# EasyEDA Pro project ax08_duplicate.eprj, schematic register
Board Name: register; Create Date: 2025-05-11; Page Name: P1; Project Name: rlpc; Schematic Name: register; Update Date: 2025-06-16; Company: EasyEDA.com; Page Size: A4; Version: V1.0
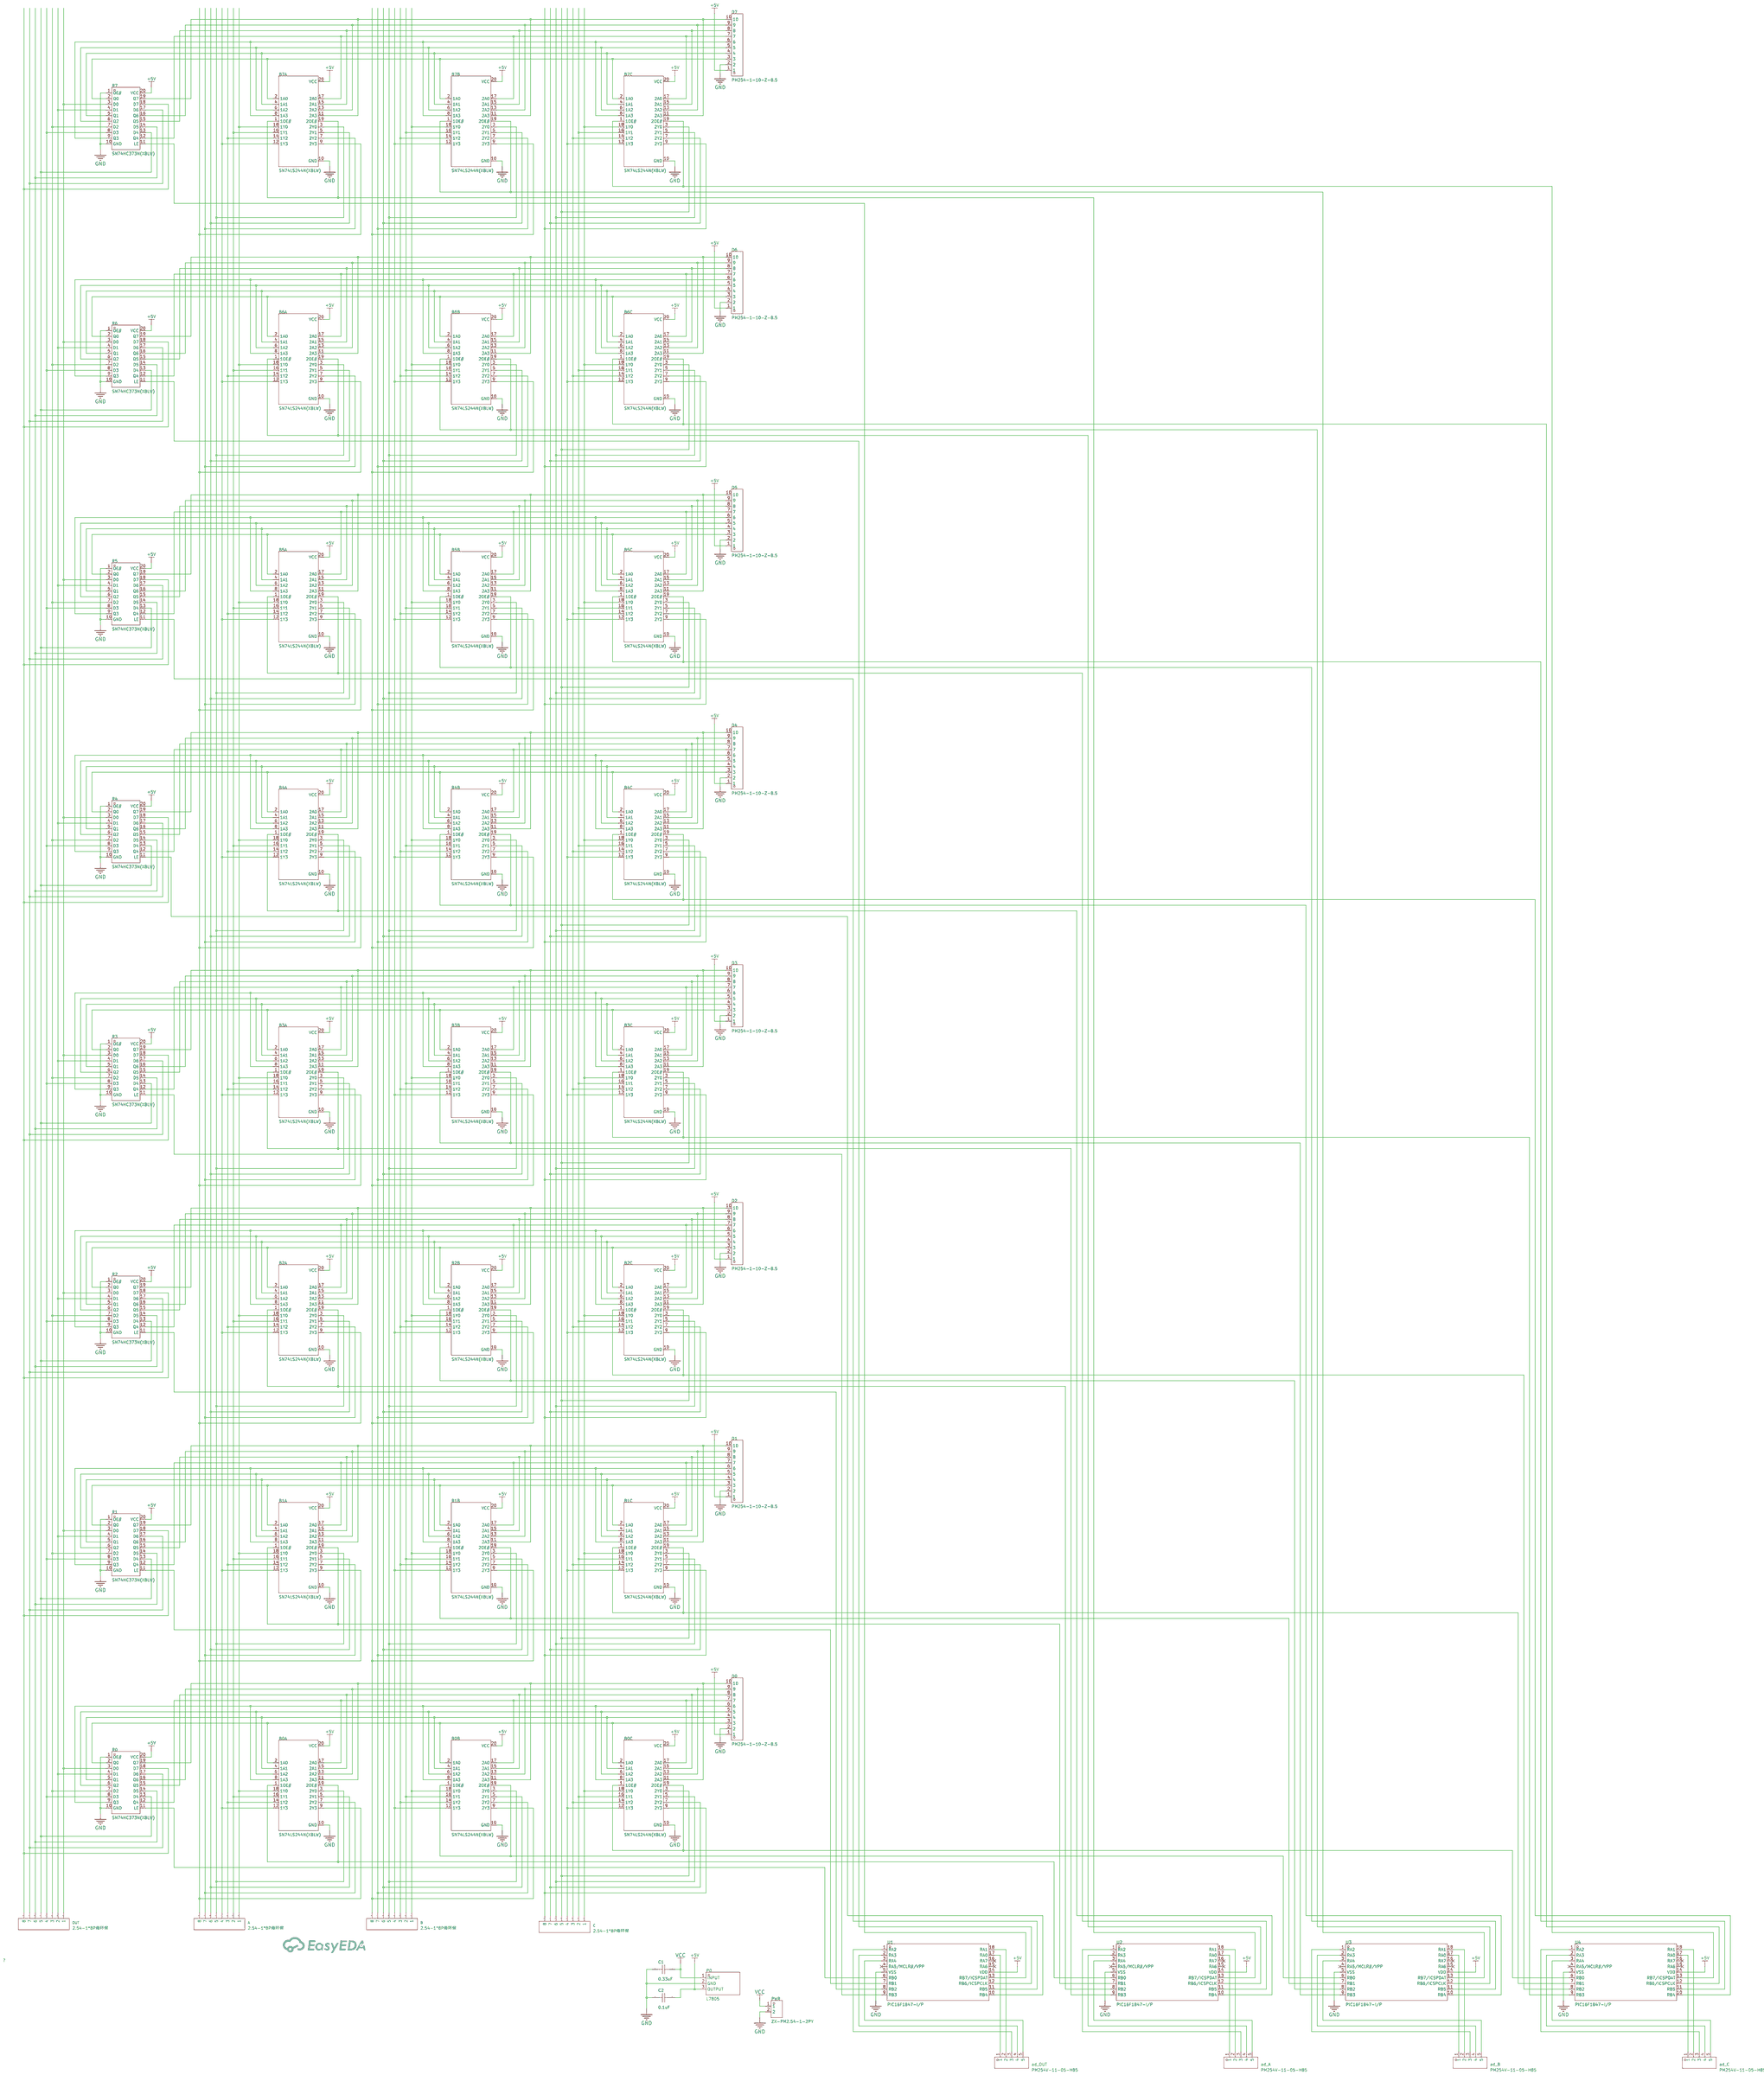
[diagram p3: schematic sheet]

## Parts
A  2.54-1*8P母环保  [HDR-TH_8P-P2.54-V-F-1]
ad_A  PM254V-11-05-H85  [HDR-TH_5P-P2.54-V-F]
ad_B  PM254V-11-05-H85  [HDR-TH_5P-P2.54-V-F]
ad_C  PM254V-11-05-H85  [HDR-TH_5P-P2.54-V-F]
ad_OUT  PM254V-11-05-H85  [HDR-TH_5P-P2.54-V-F]
B  2.54-1*8P母环保  [HDR-TH_8P-P2.54-V-F-1]
B0A  SN74LS244N(XBLW)  [PDIP-20_L26.2-W7.6-P2.54-LS7.9-BL]
B0B  SN74LS244N(XBLW)  [PDIP-20_L26.2-W7.6-P2.54-LS7.9-BL]
B0C  SN74LS244N(XBLW)  [PDIP-20_L26.2-W7.6-P2.54-LS7.9-BL]
B1A  SN74LS244N(XBLW)  [PDIP-20_L26.2-W7.6-P2.54-LS7.9-BL]
B1B  SN74LS244N(XBLW)  [PDIP-20_L26.2-W7.6-P2.54-LS7.9-BL]
B1C  SN74LS244N(XBLW)  [PDIP-20_L26.2-W7.6-P2.54-LS7.9-BL]
B2A  SN74LS244N(XBLW)  [PDIP-20_L26.2-W7.6-P2.54-LS7.9-BL]
B2B  SN74LS244N(XBLW)  [PDIP-20_L26.2-W7.6-P2.54-LS7.9-BL]
B2C  SN74LS244N(XBLW)  [PDIP-20_L26.2-W7.6-P2.54-LS7.9-BL]
B3A  SN74LS244N(XBLW)  [PDIP-20_L26.2-W7.6-P2.54-LS7.9-BL]
B3B  SN74LS244N(XBLW)  [PDIP-20_L26.2-W7.6-P2.54-LS7.9-BL]
B3C  SN74LS244N(XBLW)  [PDIP-20_L26.2-W7.6-P2.54-LS7.9-BL]
B4A  SN74LS244N(XBLW)  [PDIP-20_L26.2-W7.6-P2.54-LS7.9-BL]
B4B  SN74LS244N(XBLW)  [PDIP-20_L26.2-W7.6-P2.54-LS7.9-BL]
B4C  SN74LS244N(XBLW)  [PDIP-20_L26.2-W7.6-P2.54-LS7.9-BL]
B5A  SN74LS244N(XBLW)  [PDIP-20_L26.2-W7.6-P2.54-LS7.9-BL]
B5B  SN74LS244N(XBLW)  [PDIP-20_L26.2-W7.6-P2.54-LS7.9-BL]
B5C  SN74LS244N(XBLW)  [PDIP-20_L26.2-W7.6-P2.54-LS7.9-BL]
B6A  SN74LS244N(XBLW)  [PDIP-20_L26.2-W7.6-P2.54-LS7.9-BL]
B6B  SN74LS244N(XBLW)  [PDIP-20_L26.2-W7.6-P2.54-LS7.9-BL]
B6C  SN74LS244N(XBLW)  [PDIP-20_L26.2-W7.6-P2.54-LS7.9-BL]
B7A  SN74LS244N(XBLW)  [PDIP-20_L26.2-W7.6-P2.54-LS7.9-BL]
B7B  SN74LS244N(XBLW)  [PDIP-20_L26.2-W7.6-P2.54-LS7.9-BL]
B7C  SN74LS244N(XBLW)  [PDIP-20_L26.2-W7.6-P2.54-LS7.9-BL]
C  2.54-1*8P母环保  [HDR-TH_8P-P2.54-V-F-1]
C1  0.33uF  [CAP-TH_L6.5-W3.4-P5.00-D0.5]
C2  0.1uF  [CAP-TH_L6.5-W3.4-P5.00-D0.5]
D0  PM254-1-10-Z-8.5  [HDR-TH_10P-P2.54-V-F]
D1  PM254-1-10-Z-8.5  [HDR-TH_10P-P2.54-V-F]
D2  PM254-1-10-Z-8.5  [HDR-TH_10P-P2.54-V-F]
D3  PM254-1-10-Z-8.5  [HDR-TH_10P-P2.54-V-F]
D4  PM254-1-10-Z-8.5  [HDR-TH_10P-P2.54-V-F]
D5  PM254-1-10-Z-8.5  [HDR-TH_10P-P2.54-V-F]
D6  PM254-1-10-Z-8.5  [HDR-TH_10P-P2.54-V-F]
D7  PM254-1-10-Z-8.5  [HDR-TH_10P-P2.54-V-F]
OUT  2.54-1*8P母环保  [HDR-TH_8P-P2.54-V-F-1]
P0  L7805  [TO-220-3_L10.0-W4.5-P2.54-L]
PWR  ZX-PM2.54-1-2PY  [HDR-TH_2P-P2.54-V-F]
R0  SN74HC373N(XBLW)  [PDIP-20_L25.9-W6.6-P2.54-LS7.9-BL]
R1  SN74HC373N(XBLW)  [PDIP-20_L25.9-W6.6-P2.54-LS7.9-BL]
R2  SN74HC373N(XBLW)  [PDIP-20_L25.9-W6.6-P2.54-LS7.9-BL]
R3  SN74HC373N(XBLW)  [PDIP-20_L25.9-W6.6-P2.54-LS7.9-BL]
R4  SN74HC373N(XBLW)  [PDIP-20_L25.9-W6.6-P2.54-LS7.9-BL]
R5  SN74HC373N(XBLW)  [PDIP-20_L25.9-W6.6-P2.54-LS7.9-BL]
R6  SN74HC373N(XBLW)  [PDIP-20_L25.9-W6.6-P2.54-LS7.9-BL]
R7  SN74HC373N(XBLW)  [PDIP-20_L25.9-W6.6-P2.54-LS7.9-BL]
U1  PIC16F1847-I/P  [PDIP-18_L22.9-W6.4-P2.54-LS7.9-BL]
U2  PIC16F1847-I/P  [PDIP-18_L22.9-W6.4-P2.54-LS7.9-BL]
U3  PIC16F1847-I/P  [PDIP-18_L22.9-W6.4-P2.54-LS7.9-BL]
U4  PIC16F1847-I/P  [PDIP-18_L22.9-W6.4-P2.54-LS7.9-BL]

## Library data of the parts
A B C OUT = 2.54-1*8P母环保: Holes Structure:1x8P Pitch:2.54mm Row Spacing:- Mounting Type:Straight Number of Rows:Plugin Number of Holes:8P Insulation Height:- Contact Material:- Contact Plating:-; LCSC Part Name: 间距:2.54mm 1x8P 直插; Supplier Part: C27438; Manufacturer: BOOMELE(博穆精密); Supplier Footprint: 插件,P=2.54mm; JLCPCB Part Class: Extended Part; Datasheet: https://atta.szlcsc.com/upload/public/pdf/source/20231221/1CA800C6799ED97958773716FAA1BFFE.pdf; Supplier: LCSC; Holes Structure: 1x8P; Pitch: 2.54mm; Mounting Type: Straight; Number of Rows: Plugin; Number of Holes: 8P
ad_A ad_B ad_C ad_OUT = PM254V-11-05-H85: Holes Structure:1x5P Pitch:2.54mm Row Spacing:- Mounting Type:Straight Number of Rows:Plugin Number of Holes:5P Insulation Height:- Contact Material:Brass Contact Plating:-; LCSC Part Name: 间距:2.54mm 1x5P 直插; Supplier Part: C541852; Manufacturer: XFCN(兴飞); Supplier Footprint: 插件,P=2.54mm; JLCPCB Part Class: Extended Part; Datasheet: https://atta.szlcsc.com/upload/public/pdf/source/20200518/C541849_85853D71FC67C51915A806977A588FDA.pdf; Supplier: LCSC; Holes Structure: 1x5P; Pitch: 2.54mm; Mounting Type: Straight; Number of Rows: Plugin; Number of Holes: 5P; Contact Material: Brass
B0A B0B B0C B1A B1B B1C B2A B2B B2C B3A B3B B3C B4A B4B B4C B5A B5B B5C B6A B6B B6C B7A B7B B7C = Buffer: 8bit buffer; LCSC Part Name: SN74LS244是具有3态输出的8位bufter/line驱动器; Supplier Part: C42451381; Manufacturer: XBLW(芯伯乐); Supplier Footprint: DIP-20; Datasheet: https://atta.szlcsc.com/upload/public/pdf/source/20250116/6B2DF5498B379AFEA80B5D3D5587F69B.pdf; Supplier: LCSC; output type: Tri-State; Voltage - Supply: 2V~6V; Number of Elements: 1; Number of Bits per Element: 8; Channel Type: Unidirectional; Current - Output Low(IOL): 7.8mA; Current - Output High(IOH): 7.8mA; Logic Family: 74LSSeries; Operating Temperature: -20℃~+85℃
C1 C2 = CAP_0603: Supplier Footprint: 0603
D0-D7 = PM254-1-10-Z-8.5: Holes Structure:1x10P Pitch:2.54mm Row Spacing:- Circular Hole / Square Hole:Square Holes Mounting Type:Straight Number of Rows:Plugin Number of Holes:10P Current Rating (Max):3A Voltage Rating (Max):- Holes Direction:Top Insulation Height:8.5mm Contact M; LCSC Part Name: 1x10P 间距:2.54mm 直插; Supplier Part: C2897373; Manufacturer: HCTL(华灿天禄); Supplier Footprint: 插件,P=2.54mm; JLCPCB Part Class: Extended Part; Datasheet: https://atta.szlcsc.com/upload/public/pdf/source/20230609/534BE42964C679BDE98E061007C4ABD6.pdf; Supplier: LCSC; Holes Structure: 1x10P; Pitch: 2.54mm; Circular Hole / Square Hole: Square Holes; Mounting Type: Straight; Number of Rows: Plugin; Number of Holes: 10P; Current Rating (Max): 3A; Holes Direction: Top; Insulation Height: 8.5mm; Contact Material: Copper Alloy; Operating Temperature Range: -40℃~+105℃; Soldering Temperature(Max): 260℃@5S
P0 = L7805_C22378639: LCSC Part Name: 1.2A 5V稳压管; Supplier Part: C22378639; Manufacturer: OSEN(欧芯); Supplier Footprint: TO-220ST; JLCPCB Part Class: Extended Part; Datasheet: https://atta.szlcsc.com/upload/public/pdf/source/20240408/40E8A2502A1698F223AE0E4CC319B6CD.pdf; Supplier: LCSC
PWR = ZX-PM2.54-1-2PY: Holes Structure:1x2P Pitch:2.54mm Row Spacing:- Circular Hole / Square Hole:Square Hole Mounting Type:Direct Insert Number of Rows:Single Row Number of Holes:2P Current Rating (Max):- Voltage Rating (Max):1kV Holes Direction:Top Insulation Height:8.5mm Co; LCSC Part Name: 1x2P 间距:2.54mm 直插; Supplier Part: C7499322; Manufacturer: Megastar(兆星); Supplier Footprint: 插件,P=2.54mm; JLCPCB Part Class: Extended Part; Datasheet: https://atta.szlcsc.com/upload/public/pdf/source/20231122/F22175ABE3DCBFEB9E36A2E7DA44623C.pdf; Supplier: LCSC; Holes Structure: 1x2P; Pitch: 2.54mm; Circular Hole / Square Hole: Square Hole; Mounting Type: Direct Insert; Number of Rows: Single Row; Number of Holes: 2P; Voltage Rating (Max): 1kV; Holes Direction: Top; Insulation Height: 8.5mm; Contact Plating: Gold; Operating Temperature Range: -40℃~+105℃; Soldering Temperature(Max): 260℃@5S
R0-R7 = D-latch: 8bit D-latchwrite, output enable; LCSC Part Name: SN74HC373N; Supplier Part: C18723524; Manufacturer: XBLW(芯伯乐); Supplier Footprint: DIP-20; JLCPCB Part Class: Extended Part; Datasheet: https://atta.szlcsc.com/upload/public/pdf/source/20231019/C2B2CD29BAE77CE66F8BA3C1EE09A28D.pdf; Supplier: LCSC; Logic Type: D-Typelocking器; Output Type: Tri-State; Supply Voltage: 2V~6V; Number of Channels: 8; Source Current: -7.8mA; Sink Current: 7.8mA; Propagation Delay: 12ns; OperatingTemperature: -40℃~+105℃
U1-U4 = PIC16F1847-I/P: CPU Core:PIC Program Storage Size:16KB RAM Size:1KB GPIO Ports Number:15 Operating Voltage Range:1.8V~5.5V Operating Voltage Range:1.8V~5.5V CPU Maximum Speed:32MHz Program Memory Type:FLASH EEPROM:8KB Operating Temperature Range:-40℃~+85℃ Operating Tempe; Supplier Part: C646910; Manufacturer: MICROCHIP(美国微芯); Supplier Footprint: PDIP-18; JLCPCB Part Class: Extended Part; Datasheet: https://atta.szlcsc.com/upload/public/pdf/source/20200624/C624148_F79067E6D18DA6D6E37021FCD51102F9.pdf; Supplier: LCSC; CPU Core: PIC; Program Storage Size: 16KB; RAM Size: 1KB; GPIO Ports Number: 15; Operating Voltage Range: 1.8V~5.5V; CPU Maximum Speed: 32MHz; Program Memory Type: FLASH; EEPROM: 8KB; Operating Temperature Range: -40℃~+85℃; ADC (Bit): 10bit; Peripheral/Function: WDT；PWM; Watchdog: 有; Low-Voltage Detect: 有; Internal Oscillator: 有

## Nets
+5V: B0A.20(VCC) B0B.20(VCC) B0C.20(VCC) B1A.20(VCC) B1B.20(VCC) B1C.20(VCC) B2A.20(VCC) B2B.20(VCC) B2C.20(VCC) B3A.20(VCC) B3B.20(VCC) B3C.20(VCC) B4A.20(VCC) B4B.20(VCC) B4C.20(VCC) B5A.20(VCC) B5B.20(VCC) B5C.20(VCC) B6A.20(VCC) B6B.20(VCC) B6C.20(VCC) B7A.20(VCC) B7B.20(VCC) B7C.20(VCC) C2.1 D0.1 D1.1 D2.1 D3.1 D4.1 D5.1 D6.1 D7.1 P0.3(OUTPUT) R0.20(VCC) R1.20(VCC) R2.20(VCC) R3.20(VCC) R4.20(VCC) R5.20(VCC) R6.20(VCC) R7.20(VCC) U1.14(VDD) U2.14(VDD) U3.14(VDD) U4.14(VDD)
GND: B0A.10(GND) B0B.10(GND) B0C.10(GND) B1A.10(GND) B1B.10(GND) B1C.10(GND) B2A.10(GND) B2B.10(GND) B2C.10(GND) B3A.10(GND) B3B.10(GND) B3C.10(GND) B4A.10(GND) B4B.10(GND) B4C.10(GND) B5A.10(GND) B5B.10(GND) B5C.10(GND) B6A.10(GND) B6B.10(GND) B6C.10(GND) B7A.10(GND) B7B.10(GND) B7C.10(GND) C1.2 C2.2 D0.2 D1.2 D2.2 D3.2 D4.2 D5.2 D6.2 D7.2 P0.2(GND) PWR.2 R0.1(OE#) R0.10(GND) R1.1(OE#) R1.10(GND) R2.1(OE#) R2.10(GND) R3.1(OE#) R3.10(GND) R4.1(OE#) R4.10(GND) R5.1(OE#) R5.10(GND) R6.1(OE#) R6.10(GND) R7.1(OE#) R7.10(GND) U1.5(VSS) U2.5(VSS) U3.5(VSS) U4.5(VSS)
VCC: C1.1 P0.1(INPUT) PWR.1
$1N1032: OUT.1 R0.3(D0) R1.3(D0) R2.3(D0) R3.3(D0) R4.3(D0) R5.3(D0) R6.3(D0) R7.3(D0)
$1N1040: OUT.2 R0.4(D1) R1.4(D1) R2.4(D1) R3.4(D1) R4.4(D1) R5.4(D1) R6.4(D1) R7.4(D1)
$1N1048: OUT.3 R0.7(D2) R1.7(D2) R2.7(D2) R3.7(D2) R4.7(D2) R5.7(D2) R6.7(D2) R7.7(D2)
$1N1053: OUT.4 R0.8(D3) R1.8(D3) R2.8(D3) R3.8(D3) R4.8(D3) R5.8(D3) R6.8(D3) R7.8(D3)
$1N1067: OUT.5 R0.13(D4) R1.13(D4) R2.13(D4) R3.13(D4) R4.13(D4) R5.13(D4) R6.13(D4) R7.13(D4)
$1N1078: OUT.6 R0.14(D5) R1.14(D5) R2.14(D5) R3.14(D5) R4.14(D5) R5.14(D5) R6.14(D5) R7.14(D5)
$1N1085: OUT.7 R0.17(D6) R1.17(D6) R2.17(D6) R3.17(D6) R4.17(D6) R5.17(D6) R6.17(D6) R7.17(D6)
$1N1093: OUT.8 R0.18(D7) R1.18(D7) R2.18(D7) R3.18(D7) R4.18(D7) R5.18(D7) R6.18(D7) R7.18(D7)
$1N1101: B0A.2(1A0) B0B.2(1A0) B0C.2(1A0) D0.3 R0.2(Q0)
$1N1110: B0A.4(1A1) B0B.4(1A1) B0C.4(1A1) D0.4 R0.5(Q1)
$1N1117: B0A.6(1A2) B0B.6(1A2) B0C.6(1A2) D0.5 R0.6(Q2)
$1N1124: B0A.8(1A3) B0B.8(1A3) B0C.8(1A3) D0.6 R0.9(Q3)
$1N1131: B0A.17(2A0) B0B.17(2A0) B0C.17(2A0) D0.7 R0.12(Q4)
$1N1137: B0A.15(2A1) B0B.15(2A1) B0C.15(2A1) D0.8 R0.15(Q5)
$1N1144: B0A.13(2A2) B0B.13(2A2) B0C.13(2A2) D0.9 R0.16(Q6)
$1N1151: B0A.11(2A3) B0B.11(2A3) B0C.11(2A3) D0.10 R0.19(Q7)
$1N1268: B0A.1(1OE#) B0A.19(2OE#) U2.6(RB0)
$1N1408: A.1 B0A.18(1Y0) B1A.18(1Y0) B2A.18(1Y0) B3A.18(1Y0) B4A.18(1Y0) B5A.18(1Y0) B6A.18(1Y0) B7A.18(1Y0)
$1N1441: A.2 B0A.16(1Y1) B1A.16(1Y1) B2A.16(1Y1) B3A.16(1Y1) B4A.16(1Y1) B5A.16(1Y1) B6A.16(1Y1) B7A.16(1Y1)
$1N1446: A.3 B0A.14(1Y2) B1A.14(1Y2) B2A.14(1Y2) B3A.14(1Y2) B4A.14(1Y2) B5A.14(1Y2) B6A.14(1Y2) B7A.14(1Y2)
$1N1452: A.4 B0A.12(1Y3) B1A.12(1Y3) B2A.12(1Y3) B3A.12(1Y3) B4A.12(1Y3) B5A.12(1Y3) B6A.12(1Y3) B7A.12(1Y3)
$1N1469: A.5 B0A.3(2Y0) B1A.3(2Y0) B2A.3(2Y0) B3A.3(2Y0) B4A.3(2Y0) B5A.3(2Y0) B6A.3(2Y0) B7A.3(2Y0)
$1N1479: A.6 B0A.5(2Y1) B1A.5(2Y1) B2A.5(2Y1) B3A.5(2Y1) B4A.5(2Y1) B5A.5(2Y1) B6A.5(2Y1) B7A.5(2Y1)
$1N1487: A.7 B0A.7(2Y2) B1A.7(2Y2) B2A.7(2Y2) B3A.7(2Y2) B4A.7(2Y2) B5A.7(2Y2) B6A.7(2Y2) B7A.7(2Y2)
$1N1495: A.8 B0A.9(2Y3) B1A.9(2Y3) B2A.9(2Y3) B3A.9(2Y3) B4A.9(2Y3) B5A.9(2Y3) B6A.9(2Y3) B7A.9(2Y3)
$1N1646: B0B.1(1OE#) B0B.19(2OE#) U3.6(RB0)
$1N1652: B.1 B0B.18(1Y0) B1B.18(1Y0) B2B.18(1Y0) B3B.18(1Y0) B4B.18(1Y0) B5B.18(1Y0) B6B.18(1Y0) B7B.18(1Y0)
$1N1667: B.2 B0B.16(1Y1) B1B.16(1Y1) B2B.16(1Y1) B3B.16(1Y1) B4B.16(1Y1) B5B.16(1Y1) B6B.16(1Y1) B7B.16(1Y1)
$1N1670: B.3 B0B.14(1Y2) B1B.14(1Y2) B2B.14(1Y2) B3B.14(1Y2) B4B.14(1Y2) B5B.14(1Y2) B6B.14(1Y2) B7B.14(1Y2)
$1N1673: B.4 B0B.12(1Y3) B1B.12(1Y3) B2B.12(1Y3) B3B.12(1Y3) B4B.12(1Y3) B5B.12(1Y3) B6B.12(1Y3) B7B.12(1Y3)
$1N1676: B.5 B0B.3(2Y0) B1B.3(2Y0) B2B.3(2Y0) B3B.3(2Y0) B4B.3(2Y0) B5B.3(2Y0) B6B.3(2Y0) B7B.3(2Y0)
$1N1681: B.6 B0B.5(2Y1) B1B.5(2Y1) B2B.5(2Y1) B3B.5(2Y1) B4B.5(2Y1) B5B.5(2Y1) B6B.5(2Y1) B7B.5(2Y1)
$1N1686: B.7 B0B.7(2Y2) B1B.7(2Y2) B2B.7(2Y2) B3B.7(2Y2) B4B.7(2Y2) B5B.7(2Y2) B6B.7(2Y2) B7B.7(2Y2)
$1N1691: B.8 B0B.9(2Y3) B1B.9(2Y3) B2B.9(2Y3) B3B.9(2Y3) B4B.9(2Y3) B5B.9(2Y3) B6B.9(2Y3) B7B.9(2Y3)
$1N1818: R0.11(LE) U1.6(RB0)
$1N2665: R1.11(LE) U1.7(RB1)
$1N3481: R2.11(LE) U1.8(RB2)
$1N5225: R3.11(LE) U1.9(RB3)
$1N5336: B4B.1(1OE#) B4B.19(2OE#) U3.10(RB4)
$1N5343: R4.11(LE) U1.10(RB4)
$1N5395: B5A.11(2A3) B5B.11(2A3) B5C.11(2A3) D5.10 R5.19(Q7)
$1N5454: B5B.1(1OE#) B5B.19(2OE#) U3.11(RB5)
$1N5461: R5.11(LE) U1.11(RB5)
$1N8225: B6B.1(1OE#) B6B.19(2OE#) U3.12(RB6/ICSPCLK)
$1N8226: R6.11(LE) U1.12(RB6/ICSPCLK)
$1N8242: B7B.1(1OE#) B7B.19(2OE#) U3.13(RB7/ICSPDAT)
$1N8243: R7.11(LE) U1.13(RB7/ICSPDAT)
$1N9824: B1A.1(1OE#) B1A.19(2OE#) U2.7(RB1)
$1N9826: B2A.1(1OE#) B2A.19(2OE#) U2.8(RB2)
$1N9828: B3A.1(1OE#) B3A.19(2OE#) U2.9(RB3)
$1N9830: B4A.1(1OE#) B4A.19(2OE#) U2.10(RB4)
$1N9832: B5A.1(1OE#) B5A.19(2OE#) U2.11(RB5)
$1N9834: B6A.1(1OE#) B6A.19(2OE#) U2.12(RB6/ICSPCLK)
$1N9836: B7A.1(1OE#) B7A.19(2OE#) U2.13(RB7/ICSPDAT)
$1N9923: B1B.1(1OE#) B1B.19(2OE#) U3.7(RB1)
$1N9925: B2B.1(1OE#) B2B.19(2OE#) U3.8(RB2)
$1N9927: B3B.1(1OE#) B3B.19(2OE#) U3.9(RB3)
$1N10162: ad_OUT.1 U1.17(RA0)
$1N10167: ad_OUT.2 U1.18(RA1)
$1N10187: ad_OUT.3 U1.1(RA2)
$1N10224: ad_OUT.4 U1.2(RA3)
$1N10231: ad_OUT.5 U1.3(RA4)
$1N10427: ad_A.1 U2.17(RA0)
$1N10430: ad_A.2 U2.18(RA1)
$1N10433: ad_A.3 U2.1(RA2)
$1N10438: ad_A.4 U2.2(RA3)
$1N10443: ad_A.5 U2.3(RA4)
$1N10713: ad_B.1 U3.17(RA0)
$1N10716: ad_B.2 U3.18(RA1)
$1N10719: ad_B.3 U3.1(RA2)
$1N10724: ad_B.4 U3.2(RA3)
$1N10729: ad_B.5 U3.3(RA4)
$1N12823: B0C.1(1OE#) B0C.19(2OE#) U4.6(RB0)
$1N12829: B0C.18(1Y0) B1C.18(1Y0) B2C.18(1Y0) B3C.18(1Y0) B4C.18(1Y0) B5C.18(1Y0) B6C.18(1Y0) B7C.18(1Y0) C.1
$1N12847: B0C.16(1Y1) B1C.16(1Y1) B2C.16(1Y1) B3C.16(1Y1) B4C.16(1Y1) B5C.16(1Y1) B6C.16(1Y1) B7C.16(1Y1) C.2
$1N12865: B0C.14(1Y2) B1C.14(1Y2) B2C.14(1Y2) B3C.14(1Y2) B4C.14(1Y2) B5C.14(1Y2) B6C.14(1Y2) B7C.14(1Y2) C.3
$1N12883: B0C.12(1Y3) B1C.12(1Y3) B2C.12(1Y3) B3C.12(1Y3) B4C.12(1Y3) B5C.12(1Y3) B6C.12(1Y3) B7C.12(1Y3) C.4
$1N12901: B0C.3(2Y0) B1C.3(2Y0) B2C.3(2Y0) B3C.3(2Y0) B4C.3(2Y0) B5C.3(2Y0) B6C.3(2Y0) B7C.3(2Y0) C.5
$1N12935: B0C.5(2Y1) B1C.5(2Y1) B2C.5(2Y1) B3C.5(2Y1) B4C.5(2Y1) B5C.5(2Y1) B6C.5(2Y1) B7C.5(2Y1) C.6
$1N12969: B0C.7(2Y2) B1C.7(2Y2) B2C.7(2Y2) B3C.7(2Y2) B4C.7(2Y2) B5C.7(2Y2) B6C.7(2Y2) B7C.7(2Y2) C.7
$1N13003: B0C.9(2Y3) B1C.9(2Y3) B2C.9(2Y3) B3C.9(2Y3) B4C.9(2Y3) B5C.9(2Y3) B6C.9(2Y3) B7C.9(2Y3) C.8
$1N13037: B1A.2(1A0) B1B.2(1A0) B1C.2(1A0) D1.3 R1.2(Q0)
$1N13038: B1A.17(2A0) B1B.17(2A0) B1C.17(2A0) D1.7 R1.12(Q4)
$1N13039: B1A.15(2A1) B1B.15(2A1) B1C.15(2A1) D1.8 R1.15(Q5)
$1N13040: B1A.13(2A2) B1B.13(2A2) B1C.13(2A2) D1.9 R1.16(Q6)
$1N13041: B1A.11(2A3) B1B.11(2A3) B1C.11(2A3) D1.10 R1.19(Q7)
$1N13042: B1A.8(1A3) B1B.8(1A3) B1C.8(1A3) D1.6 R1.9(Q3)
$1N13043: B1A.6(1A2) B1B.6(1A2) B1C.6(1A2) D1.5 R1.6(Q2)
$1N13044: B1A.4(1A1) B1B.4(1A1) B1C.4(1A1) D1.4 R1.5(Q1)
$1N13047: B2A.2(1A0) B2B.2(1A0) B2C.2(1A0) D2.3 R2.2(Q0)
$1N13048: B2A.17(2A0) B2B.17(2A0) B2C.17(2A0) D2.7 R2.12(Q4)
$1N13049: B2A.15(2A1) B2B.15(2A1) B2C.15(2A1) D2.8 R2.15(Q5)
$1N13050: B2A.13(2A2) B2B.13(2A2) B2C.13(2A2) D2.9 R2.16(Q6)
$1N13051: B2A.11(2A3) B2B.11(2A3) B2C.11(2A3) D2.10 R2.19(Q7)
$1N13052: B2A.8(1A3) B2B.8(1A3) B2C.8(1A3) D2.6 R2.9(Q3)
$1N13053: B2A.6(1A2) B2B.6(1A2) B2C.6(1A2) D2.5 R2.6(Q2)
$1N13054: B2A.4(1A1) B2B.4(1A1) B2C.4(1A1) D2.4 R2.5(Q1)
$1N13057: B3A.2(1A0) B3B.2(1A0) B3C.2(1A0) D3.3 R3.2(Q0)
$1N13058: B3A.17(2A0) B3B.17(2A0) B3C.17(2A0) D3.7 R3.12(Q4)
$1N13059: B3A.15(2A1) B3B.15(2A1) B3C.15(2A1) D3.8 R3.15(Q5)
$1N13060: B3A.13(2A2) B3B.13(2A2) B3C.13(2A2) D3.9 R3.16(Q6)
$1N13061: B3A.11(2A3) B3B.11(2A3) B3C.11(2A3) D3.10 R3.19(Q7)
$1N13062: B3A.8(1A3) B3B.8(1A3) B3C.8(1A3) D3.6 R3.9(Q3)
$1N13063: B3A.6(1A2) B3B.6(1A2) B3C.6(1A2) D3.5 R3.6(Q2)
$1N13064: B3A.4(1A1) B3B.4(1A1) B3C.4(1A1) D3.4 R3.5(Q1)
$1N13067: B4A.2(1A0) B4B.2(1A0) B4C.2(1A0) D4.3 R4.2(Q0)
$1N13068: B4A.17(2A0) B4B.17(2A0) B4C.17(2A0) D4.7 R4.12(Q4)
$1N13069: B4A.15(2A1) B4B.15(2A1) B4C.15(2A1) D4.8 R4.15(Q5)
$1N13070: B4A.13(2A2) B4B.13(2A2) B4C.13(2A2) D4.9 R4.16(Q6)
$1N13071: B4A.11(2A3) B4B.11(2A3) B4C.11(2A3) D4.10 R4.19(Q7)
$1N13072: B4A.8(1A3) B4B.8(1A3) B4C.8(1A3) D4.6 R4.9(Q3)
$1N13073: B4A.6(1A2) B4B.6(1A2) B4C.6(1A2) D4.5 R4.6(Q2)
$1N13074: B4A.4(1A1) B4B.4(1A1) B4C.4(1A1) D4.4 R4.5(Q1)
$1N13077: B4C.1(1OE#) B4C.19(2OE#) U4.10(RB4)
$1N13083: B5A.2(1A0) B5B.2(1A0) B5C.2(1A0) D5.3 R5.2(Q0)
$1N13084: B5A.17(2A0) B5B.17(2A0) B5C.17(2A0) D5.7 R5.12(Q4)
$1N13085: B5A.15(2A1) B5B.15(2A1) B5C.15(2A1) D5.8 R5.15(Q5)
$1N13086: B5A.13(2A2) B5B.13(2A2) B5C.13(2A2) D5.9 R5.16(Q6)
$1N13091: B5A.8(1A3) B5B.8(1A3) B5C.8(1A3) D5.6 R5.9(Q3)
$1N13092: B5A.6(1A2) B5B.6(1A2) B5C.6(1A2) D5.5 R5.6(Q2)
$1N13093: B5A.4(1A1) B5B.4(1A1) B5C.4(1A1) D5.4 R5.5(Q1)
$1N13096: B5C.1(1OE#) B5C.19(2OE#) U4.11(RB5)
$1N13102: B6A.2(1A0) B6B.2(1A0) B6C.2(1A0) D6.3 R6.2(Q0)
$1N13103: B6A.17(2A0) B6B.17(2A0) B6C.17(2A0) D6.7 R6.12(Q4)
$1N13104: B6A.15(2A1) B6B.15(2A1) B6C.15(2A1) D6.8 R6.15(Q5)
$1N13105: B6A.13(2A2) B6B.13(2A2) B6C.13(2A2) D6.9 R6.16(Q6)
$1N13106: B6A.11(2A3) B6B.11(2A3) B6C.11(2A3) D6.10 R6.19(Q7)
$1N13107: B6A.8(1A3) B6B.8(1A3) B6C.8(1A3) D6.6 R6.9(Q3)
$1N13108: B6A.6(1A2) B6B.6(1A2) B6C.6(1A2) D6.5 R6.6(Q2)
$1N13109: B6A.4(1A1) B6B.4(1A1) B6C.4(1A1) D6.4 R6.5(Q1)
$1N13112: B6C.1(1OE#) B6C.19(2OE#) U4.12(RB6/ICSPCLK)
$1N13118: B7A.2(1A0) B7B.2(1A0) B7C.2(1A0) D7.3 R7.2(Q0)
$1N13119: B7A.17(2A0) B7B.17(2A0) B7C.17(2A0) D7.7 R7.12(Q4)
$1N13120: B7A.15(2A1) B7B.15(2A1) B7C.15(2A1) D7.8 R7.15(Q5)
$1N13121: B7A.13(2A2) B7B.13(2A2) B7C.13(2A2) D7.9 R7.16(Q6)
$1N13122: B7A.11(2A3) B7B.11(2A3) B7C.11(2A3) D7.10 R7.19(Q7)
$1N13123: B7A.8(1A3) B7B.8(1A3) B7C.8(1A3) D7.6 R7.9(Q3)
$1N13124: B7A.6(1A2) B7B.6(1A2) B7C.6(1A2) D7.5 R7.6(Q2)
$1N13125: B7A.4(1A1) B7B.4(1A1) B7C.4(1A1) D7.4 R7.5(Q1)
$1N13128: B7C.1(1OE#) B7C.19(2OE#) U4.13(RB7/ICSPDAT)
$1N13134: B3C.1(1OE#) B3C.19(2OE#) U4.9(RB3)
$1N13140: B2C.1(1OE#) B2C.19(2OE#) U4.8(RB2)
$1N13146: B1C.1(1OE#) B1C.19(2OE#) U4.7(RB1)
$1N15976: ad_C.1 U4.17(RA0)
$1N15979: ad_C.2 U4.18(RA1)
$1N15982: ad_C.3 U4.1(RA2)
$1N15987: ad_C.4 U4.2(RA3)
$1N15992: ad_C.5 U4.3(RA4)

Not connected (* = marked no-connect by the designer): U1 4(RA5/MCLR#/VPP)* 15(RA6)* 16(RA7)*; U2 4(RA5/MCLR#/VPP)* 15(RA6)* 16(RA7)*; U3 4(RA5/MCLR#/VPP)* 15(RA6)* 16(RA7)*; U4 4(RA5/MCLR#/VPP)* 15(RA6)* 16(RA7)*
